# Altium schematic sheet Sheet1.SchDoc
size A4
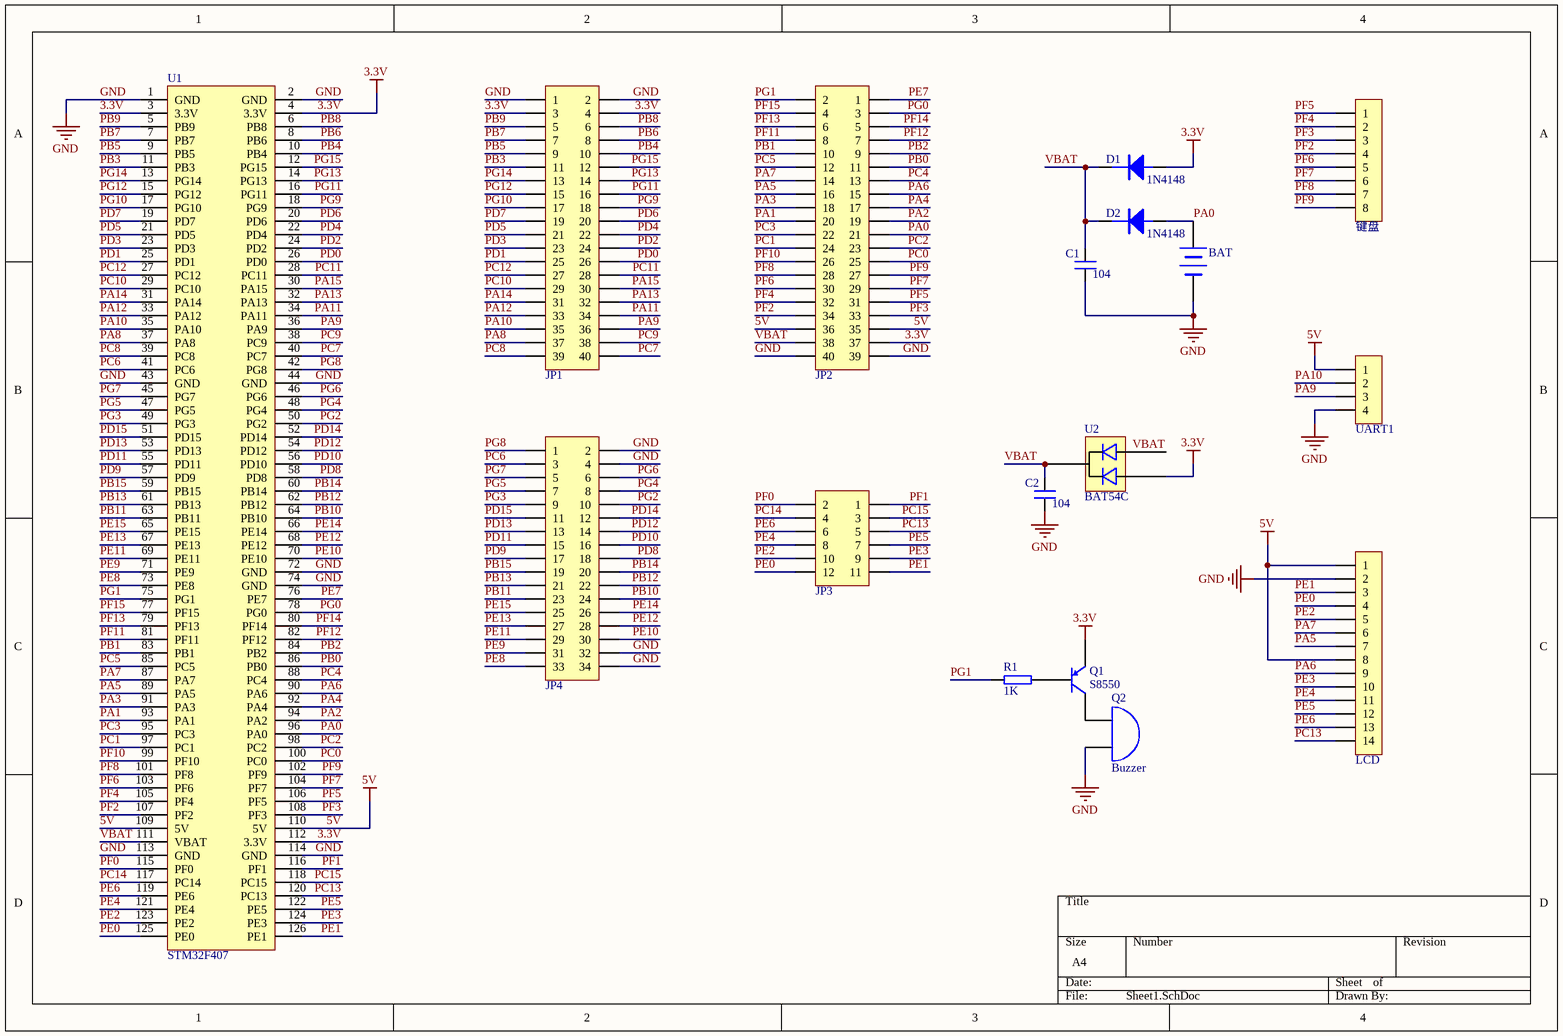
[diagram p0: Sheet1.SchDoc]

## Parts
BAT  (no value)  [BAT_SMD]
C1  104  [0805C]
C2  104  [0805C]
D1  1N4148  [SOD-123]
D2  1N4148  [SOD-123]
JP1  Header 2X11  [HDR-20X2]  (value not drawn)
JP2  Header 2X11  [HDR-20X2]  (value not drawn)
JP3  Header 6X2  [HDR-6X2]  (value not drawn)
JP4  Header 2X11  [HDR-17X2]  (value not drawn)
LCD  HDR-1X14  [HDR-1X14_M]  (value not drawn)
Q1  S8550  [BAT54C/S8550]
Q2  Buzzer  [7525蜂鸣器]
R1  1K  [0805R]
U1  STM32F407  [STM32F407ZGT6]
U2  BAT54C  [BAT54C]
UART1  HDR-1X4  [HDR-1X4]  (value not drawn)
键盘  HDR-1X8  [HDR-1X8_M]  (value not drawn)

## Nets
3.3V: D1.1(A) JP1.3 JP1.4 JP2.37 Q1.1(E) U1.3(3.3V) U1.4(3.3V) U1.112(3.3V) U2.2
5V: JP2.35 JP2.36 LCD.1 LCD.8 U1.109(5V) U1.110(5V) UART1.1
GND: BAT.2(-) C1.1 C2.2 JP1.1 JP1.2 JP2.39 JP2.40 JP4.2 JP4.4 JP4.32 JP4.34 LCD.2 Q2.2 U1.1(GND) U1.2(GND) U1.43(GND) U1.44(GND) U1.72(GND) U1.74(GND) U1.113(GND) U1.114(GND) UART1.4
PA0: BAT.1(+) D2.1(A) JP2.21 U1.96(PA0)
PA1: JP2.20 U1.93(PA1)
PA2: JP2.19 U1.94(PA2)
PA3: JP2.18 U1.91(PA3)
PA4: JP2.17 U1.92(PA4)
PA5: JP2.16 LCD.7 U1.89(PA5)
PA6: JP2.15 LCD.9 U1.90(PA6)
PA7: JP2.14 LCD.6 U1.87(PA7)
PA8: JP1.37 U1.37(PA8)
PA9: JP1.36 U1.36(PA9) UART1.3
PA10: JP1.35 U1.35(PA10) UART1.2
PA11: JP1.34 U1.34(PA11)
PA12: JP1.33 U1.33(PA12)
PA13: JP1.32 U1.32(PA13)
PA14: JP1.31 U1.31(PA14)
PA15: JP1.30 U1.30(PA15)
PB0: JP2.11 U1.86(PB0)
PB1: JP2.10 U1.83(PB1)
PB2: JP2.9 U1.84(PB2)
PB3: JP1.11 U1.11(PB3)
PB4: JP1.10 U1.10(PB4)
PB5: JP1.9 U1.9(PB5)
PB6: JP1.8 U1.8(PB6)
PB7: JP1.7 U1.7(PB7)
PB8: JP1.6 U1.6(PB8)
PB9: JP1.5 U1.5(PB9)
PB10: JP4.24 U1.64(PB10)
PB11: JP4.23 U1.63(PB11)
PB12: JP4.22 U1.62(PB12)
PB13: JP4.21 U1.61(PB13)
PB14: JP4.20 U1.60(PB14)
PB15: JP4.19 U1.59(PB15)
PC0: JP2.25 U1.100(PC0)
PC1: JP2.24 U1.97(PC1)
PC2: JP2.23 U1.98(PC2)
PC3: JP2.22 U1.95(PC3)
PC4: JP2.13 U1.88(PC4)
PC5: JP2.12 U1.85(PC5)
PC6: JP4.3 U1.41(PC6)
PC7: JP1.40 U1.40(PC7)
PC8: JP1.39 U1.39(PC8)
PC9: JP1.38 U1.38(PC9)
PC10: JP1.29 U1.29(PC10)
PC11: JP1.28 U1.28(PC11)
PC12: JP1.27 U1.27(PC12)
PC13: JP3.5 LCD.14 U1.120(PC13)
PC14: JP3.4 U1.117(PC14)
PC15: JP3.3 U1.118(PC15)
PD0: JP1.26 U1.26(PD0)
PD1: JP1.25 U1.25(PD1)
PD2: JP1.24 U1.24(PD2)
PD3: JP1.23 U1.23(PD3)
PD4: JP1.22 U1.22(PD4)
PD5: JP1.21 U1.21(PD5)
PD6: JP1.20 U1.20(PD6)
PD7: JP1.19 U1.19(PD7)
PD8: JP4.18 U1.58(PD8)
PD9: JP4.17 U1.57(PD9)
PD10: JP4.16 U1.56(PD10)
PD11: JP4.15 U1.55(PD11)
PD12: JP4.14 U1.54(PD12)
PD13: JP4.13 U1.53(PD13)
PD14: JP4.12 U1.52(PD14)
PD15: JP4.11 U1.51(PD15)
PE0: JP3.12 LCD.4 U1.125(PE0)
PE1: JP3.11 LCD.3 U1.126(PE1)
PE2: JP3.10 LCD.5 U1.123(PE2)
PE3: JP3.9 LCD.10 U1.124(PE3)
PE4: JP3.8 LCD.11 U1.121(PE4)
PE5: JP3.7 LCD.12 U1.122(PE5)
PE6: JP3.6 LCD.13 U1.119(PE6)
PE7: JP2.1 U1.76(PE7)
PE8: JP4.33 U1.73(PE8)
PE9: JP4.31 U1.71(PE9)
PE10: JP4.30 U1.70(PE10)
PE11: JP4.29 U1.69(PE11)
PE12: JP4.28 U1.68(PE12)
PE13: JP4.27 U1.67(PE13)
PE14: JP4.26 U1.66(PE14)
PE15: JP4.25 U1.65(PE15)
PF0: JP3.2 U1.115(PF0)
PF1: JP3.1 U1.116(PF1)
PF2: JP2.34 U1.107(PF2) 键盘.4
PF3: JP2.33 U1.108(PF3) 键盘.3
PF4: JP2.32 U1.105(PF4) 键盘.2
PF5: JP2.31 U1.106(PF5) 键盘.1
PF6: JP2.30 U1.103(PF6) 键盘.5
PF7: JP2.29 U1.104(PF7) 键盘.6
PF8: JP2.28 U1.101(PF8) 键盘.7
PF9: JP2.27 U1.102(PF9) 键盘.8
PF10: JP2.26 U1.99(PF10)
PF11: JP2.8 U1.81(PF11)
PF12: JP2.7 U1.82(PF12)
PF13: JP2.6 U1.79(PF13)
PF14: JP2.5 U1.80(PF14)
PF15: JP2.4 U1.77(PF15)
PG0: JP2.3 U1.78(PG0)
PG1: JP2.2 R1.1 U1.75(PG1)
PG2: JP4.10 U1.50(PG2)
PG3: JP4.9 U1.49(PG3)
PG4: JP4.8 U1.48(PG4)
PG5: JP4.7 U1.47(PG5)
PG6: JP4.6 U1.46(PG6)
PG7: JP4.5 U1.45(PG7)
PG8: JP4.1 U1.42(PG8)
PG9: JP1.18 U1.18(PG9)
PG10: JP1.17 U1.17(PG10)
PG11: JP1.16 U1.16(PG11)
PG12: JP1.15 U1.15(PG12)
PG13: JP1.14 U1.14(PG13)
PG14: JP1.13 U1.13(PG14)
PG15: JP1.12 U1.12(PG15)
VBAT: C1.2 C2.1 D1.2(K) D2.2(K) JP2.38 U1.111(VBAT) U2.1 U2.3
NetQ1_2: Q1.2(B) R1.2
NetQ1_3: Q1.3(C) Q2.1

## Library data of the parts
BAT = battery
C1 C2 = Capacitor: 电容; BOM名称: 无极性贴片电容; 版权归属: 源创客; 学习资源: www.ooocke.com
D1 D2 = 二极管
JP1 JP2 = Header 20X2u: 20*2P接插件; 版权归属: 源创客; BOM名称: 20*2P接插件; 学习资源: www.ooocke.com
JP3 = Header  6X2u: 6*2P接插件; 版权归属: 源创客; BOM名称: 6*2P接插件; 学习资源: www.ooocke.com
JP4 = Header 17X2u: 17*2P接插件; 版权归属: 源创客; BOM名称: 17*2P接插件; 学习资源: www.ooocke.com
LCD = Header 14u: 14P接插件; 版权归属: 源创客; BOM名称: 14P接插件; 学习资源: www.ooocke.com
R1 = Resistor: 电阻; BOM名称: 贴片电阻; 版权归属: 源创客; 学习资源: www.ooocke.com
U1 = STM32F407: Header, 126-Pin, Dual row; LatestRevisionDate: 17-Jul-2002; LatestRevisionNote: Re-released for DXP Platform.; Publisher: Altium Limited
UART1 = Header 4u: 4P接插件; 版权归属: 源创客; BOM名称: 4P接插件; 学习资源: www.ooocke.com
键盘 = Header 8u: 8P接插件; 版权归属: 源创客; BOM名称: 8P接插件; 学习资源: www.ooocke.com